# Altium schematic sheet 0202_GPP_MUX_I_R.SchDoc
size A3
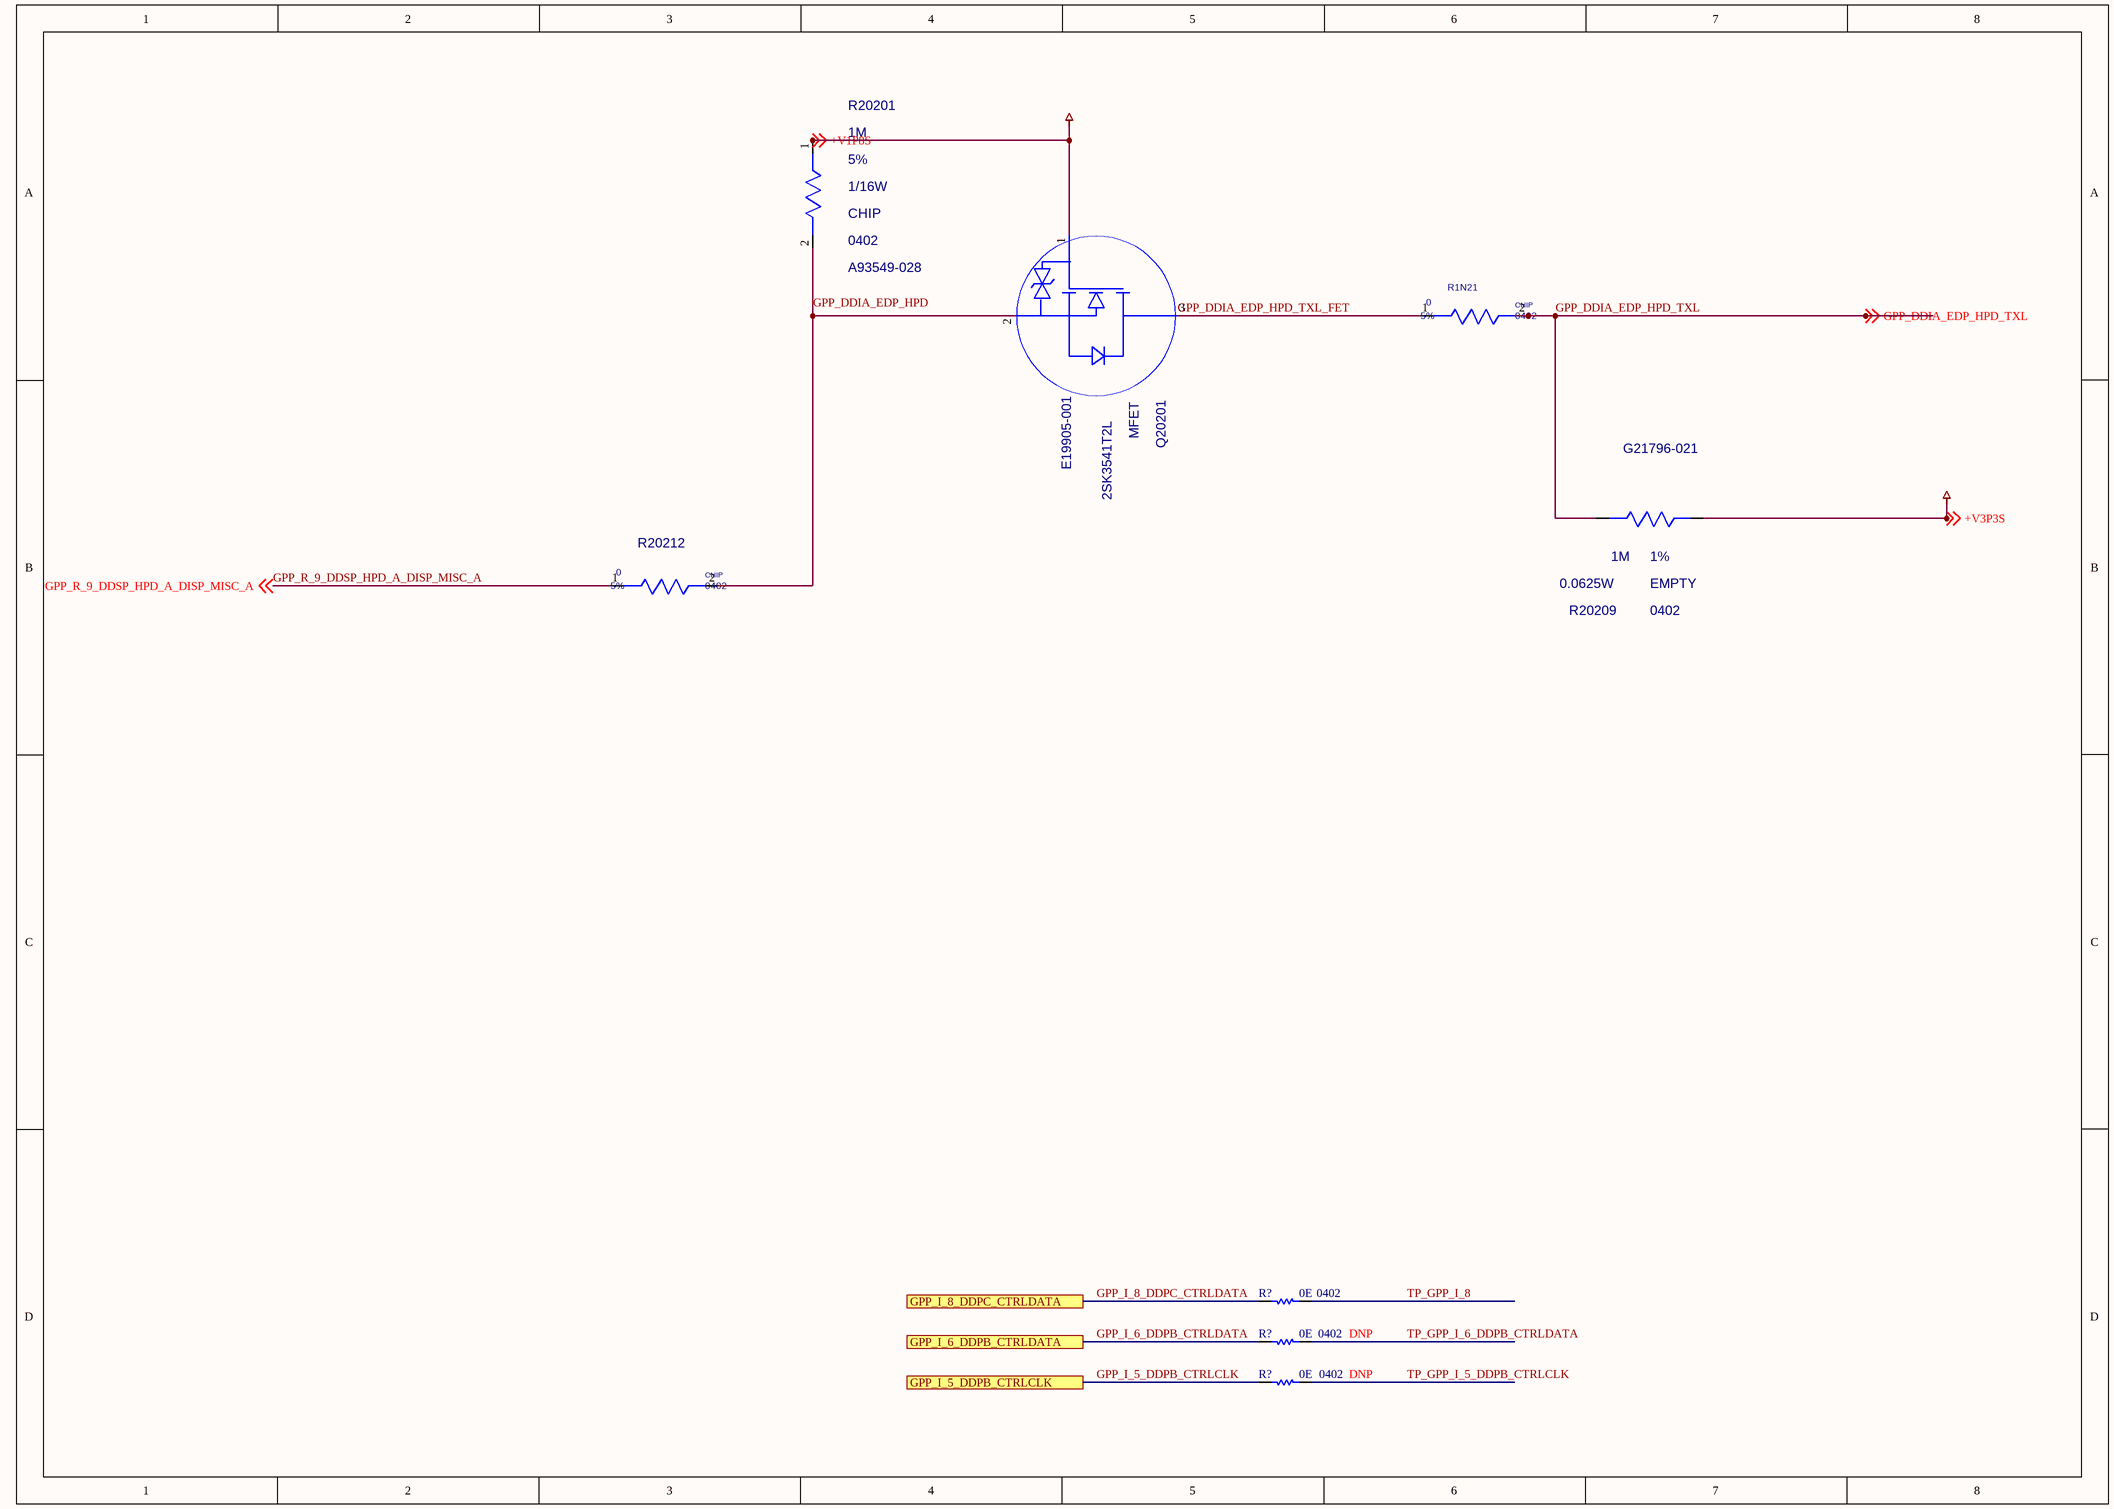
[diagram p0: 0202_GPP_MUX_I_R.SchDoc]

## Parts
(Parts that share a designator on the sheet are numbered #1, #2 ... from top to bottom, then left to right.)
Q20201  2SK3541T2L  MATERIAL: MFET  PART_NUMBER: E19905-001  [CTK2_SOT723_900X1300_400_MA]
R1N21  0  MATERIAL: CHIP  PACK_TYPE: 0402  TOLERANCE: 5%  [SMR0402IA]
R20201  1M  MATERIAL: CHIP  PACK_TYPE: 0402  PART_NUMBER: A93549-028  TOLERANCE: 5%  WATTAGE: 1/16W  [SMR0402IA]
R20209  1M  MATERIAL: EMPTY  PACK_TYPE: 0402  PART_NUMBER: G21796-021  TOLERANCE: 1%  WATTAGE: 0.0625W  [CTK2_SM0402_1100X550_MA]
R20212  0  MATERIAL: CHIP  PACK_TYPE: 0402  TOLERANCE: 5%  [SMR0402IA]
R?#1  value 0E  Case/Package: 0402  [RESC0402]  (hidden comment: Res)
R?#2  value 0E  Case/Package: 0402  [RESC0402]  (hidden comment: Res)
R?#3  value 0E  Case/Package: 0402  [RESC0402]  (hidden comment: Res)

## Ports
GPP_I_5_DDPB_CTRLCLK, GPP_I_6_DDPB_CTRLDATA, GPP_I_8_DDPC_CTRLDATA

## Nets
+V1P8S: Q20201.1(G) R20201.1(A) ; off-sheet +V1P8S
+V3P3S: R20209.2(B) ; off-sheet +V3P3S
GPP_DDIA_EDP_HPD: Q20201.2(S) R20201.2(B) R20212.2(B)
GPP_DDIA_EDP_HPD_TXL: R1N21.2(B) R20209.1(A) ; off-sheet GPP_DDIA_EDP_HPD_TXL
GPP_DDIA_EDP_HPD_TXL_FET: Q20201.3(D) R1N21.1(A)
GPP_I_5_DDPB_CTRLCLK: R?#3.1 ; port GPP_I_5_DDPB_CTRLCLK
GPP_I_6_DDPB_CTRLDATA: R?#2.1 ; port GPP_I_6_DDPB_CTRLDATA
GPP_I_8_DDPC_CTRLDATA: R?#1.1 ; port GPP_I_8_DDPC_CTRLDATA
GPP_R_9_DDSP_HPD_A_DISP_MISC_A: R20212.1(A) ; off-sheet GPP_R_9_DDSP_HPD_A_DISP_MISC_A
TP_GPP_I_5_DDPB_CTRLCLK: R?#3.2
TP_GPP_I_6_DDPB_CTRLDATA: R?#2.2
TP_GPP_I_8: R?#1.2

## Library data of the parts
Q20201 = C_MOSFET_N_ESD: CDS_PHYS_PART_NAME: C_MOSFET_N_ESD_SOT723-E19905-001,MFET,2SK3541T2L,TK2,GENERIC; CDS_LMAN_SYM_OUTLINE: -150,150,150,-150; FP_TECH: TK2; IP: GENERIC; PACK_TYPE: SOT723; ROOM: NONE; OriginalSymbolOrigin: (-150,150); XY: (-5850,1900); VER: 1; ROT: 5; PHYS_PAGE: 202; LOCATION: Q20201; DRAWING: @RVP1_ADL_SB_ADP_S_DDR5_SODIMM_2DPC_LIB.H55_DG2_2DPC(SCH_1):PAGE571; CDS_LIB: local; VARIANT: ?; PCB Footprint: CTK2_SOT723_900X1300_400_MA; CHIPS_PART_NAME: C_MOSFET_N_ESD; CDS_PART_NAME: C_MOSFET_N_ESD_SOT723-E19905-001,MFET,2SK3541T2L,TK2,GENERIC; CDS_LOCATION: Q20201
R1N21 = RES#1: PART_NUMBER: A93549-001; CHIPS_PART_NAME: RES; CDS_PHYS_PART_NAME: RES_0402-A93549-001,CHIP,0,5%,1/16W,LPDB,GENERIC; WATTAGE: 1/16W; OriginalSymbolOrigin: (-75,25); XY: (-4925,1900); VER: 1; PHYS_PAGE: 202; LOCATION: R1N21; IP: GENERIC; FP_TECH: LPDB; DRAWING: @RVP1_ADL_SB_ADP_S_DDR5_SODIMM_2DPC_LIB.H55_DG2_2DPC(SCH_1):PAGE571; CDS_LIB: discrete; PCB Footprint: SMR0402IA; SEC_TYPE: 0402; ROT: 0; CDS_PART_NAME: RES_0402-A93549-001,CHIP,0,5%,1/16W,LPDB,GENERIC; CDS_LOCATION: R1N21; ASI_MODEL: A93549-001
R20201 = RES: CDS_PHYS_PART_NAME: RES_0402-A93549-028,CHIP,1M,5%,1/16W,LPDB,GENERIC; OriginalSymbolOrigin: (-25,75); XY: (-6375,2250); VER: 2; ROT: 0; PHYS_PAGE: 202; LOCATION: R20201; IP: GENERIC; FP_TECH: LPDB; DRAWING: @RVP1_ADL_SB_ADP_S_DDR5_SODIMM_2DPC_LIB.H55_DG2_2DPC(SCH_1):PAGE571; CDS_LIB: discrete; PCB Footprint: SMR0402IA; CHIPS_PART_NAME: RES; CDS_PART_NAME: RES_0402-A93549-028,CHIP,1M,5%,1/16W,LPDB,GENERIC; CDS_LOCATION: R20201
R20209 = C_RES#1: CHIPS_PART_NAME: C_RES; CDS_PHYS_PART_NAME: C_RES_0402-G21796-021,EMPTY,1M,1%,0.0625W,TK2,GENERIC; CDS_LMAN_SYM_OUTLINE: -50,50,50,-50; FP_TECH: TK2; IP: GENERIC; ROOM: NONE; OriginalSymbolOrigin: (-75,25); XY: (-4525,1525); VER: 1; ROT: 0; PHYS_PAGE: 202; LOCATION: R20209; DRAWING: @RVP1_ADL_SB_ADP_S_DDR5_SODIMM_2DPC_LIB.H55_DG2_2DPC(SCH_1):PAGE571; CDS_LIB: c_discrete; VARIANT: ?; PCB Footprint: CTK2_SM0402_1100X550_MA; CDS_PART_NAME: C_RES_0402-G21796-021,EMPTY,1M,1%,0.0625W,TK2,GENERIC; CDS_LOCATION: R20209
R20212 = RES#1: PART_NUMBER: A93549-001; CHIPS_PART_NAME: RES; CDS_PHYS_PART_NAME: RES_0402-A93549-001,CHIP,0,5%,1/16W,LPDB,GENERIC; WATTAGE: 1/16W; OriginalSymbolOrigin: (-75,25); XY: (-6650,1400); VER: 1; PHYS_PAGE: 202; LOCATION: R20212; IP: GENERIC; FP_TECH: LPDB; DRAWING: @RVP1_ADL_SB_ADP_S_DDR5_SODIMM_2DPC_LIB.H55_DG2_2DPC(SCH_1):PAGE571; CDS_LIB: discrete; PCB Footprint: SMR0402IA; ROT: 0; CDS_PART_NAME: RES_0402-A93549-001,CHIP,0,5%,1/16W,LPDB,GENERIC; CDS_LOCATION: R20212; ASI_MODEL: A93549-001
R?#1-R?#3 = Res: Thick Film Resistor -  0ohm, 1%, 0402
  R?#2 R?#3: DNP: DNP